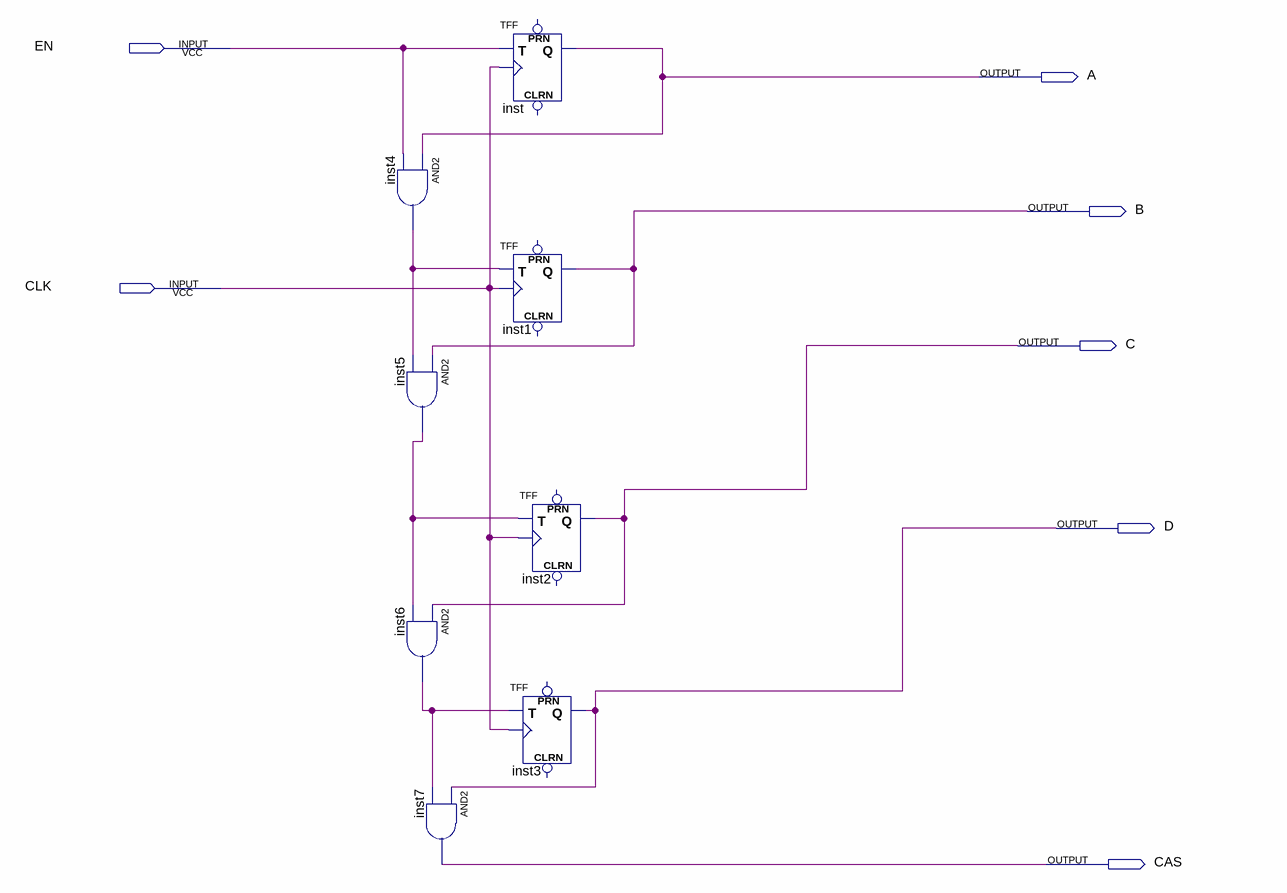
[diagram p0: schematic sheet]
// Quartus schematic counter.bdf as structural Verilog: 8 symbols, 7 pins
module counter (
  input  EN,
  input  CLK,
  output A,
  output B,
  output C,
  output D,
  output CAS
);

  wire inst4_out, inst5_out, inst6_out;

  and inst4 (inst4_out, A, EN);
  and inst5 (inst5_out, B, inst4_out);
  and inst6 (inst6_out, C, inst5_out);
  and inst7 (CAS, D, inst6_out);
  TFF inst (.T(EN), .CLK(CLK), .Q(A));  // open: PRN, CLRN
  TFF inst1 (.T(inst4_out), .CLK(CLK), .Q(B));  // open: PRN, CLRN
  TFF inst2 (.T(inst5_out), .CLK(CLK), .Q(C));  // open: PRN, CLRN
  TFF inst3 (.T(inst6_out), .CLK(CLK), .Q(D));  // open: PRN, CLRN
endmodule
